# Altium schematic sheet Tarefinha.SchDoc
size A4; SheetNumber: 1; SheetTotal: 1
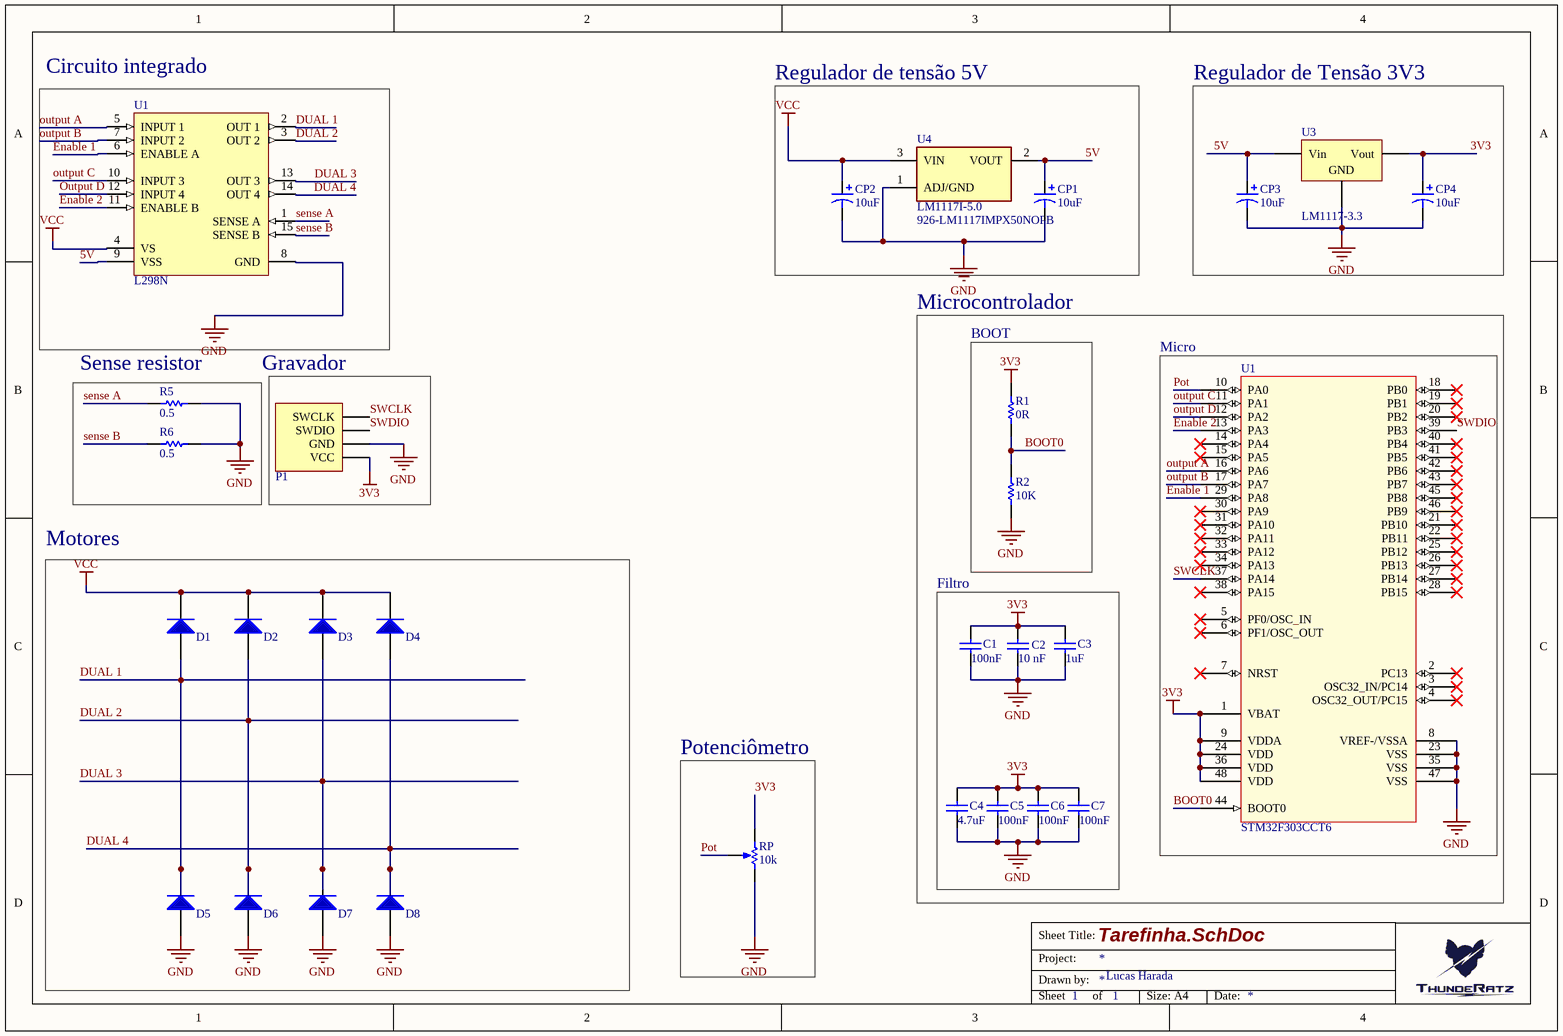
[diagram p0: Tarefinha.SchDoc]

## Parts
(Parts that share a designator on the sheet are numbered #1, #2 ... from top to bottom, then left to right.)
C1  100nF  [CAP CER DISK 100NF 50V - duplicate]
C2  10 nF  [Cap Film 0.1uF]
C3  1uF  [Cap Film 0.1uF]
C4  4.7uF  [CAP CER DISK 100NF 50V - duplicate]
C5  100nF  [CAP CER DISK 100NF 50V - duplicate]
C6  100nF  [CAP CER DISK 100NF 50V - duplicate]
C7  100nF  [CAP CER DISK 100NF 50V - duplicate]
CP1  10uF  [CAP RAD 10UF 35V]
CP2  10uF  [CAP RAD 10UF 35V]
CP3  10uF  [CAP RAD 10UF 35V]
CP4  10uF  [CAP RAD 10UF 35V]
D1  1n4148  [DO-41]  (value not drawn)
D2  1n4148  [DO-41]  (value not drawn)
D3  1n4148  [DO-41]  (value not drawn)
D4  1n4148  [DO-41]  (value not drawn)
D5  1n4148  [DO-41]  (value not drawn)
D6  1n4148  [DO-41]  (value not drawn)
D7  1n4148  [DO-41]  (value not drawn)
D8  1n4148  [DO-41]  (value not drawn)
P1  Gravador ST  [HDR1X4]  (value not drawn)
R1  0R  [RES 10K 1/4W CARBON FILM]
R2  10K  [RES 10K 1/4W CARBON FILM]
R5  0.5  [RES 10K 1/4W CARBON FILM]
R6  0.5  [RES 10K 1/4W CARBON FILM]
RP  Resistance (Ohms): 10k  [Pot 10k]  (hidden comment: Pot 10k)
U1#1  L298N  [STM-FM-15]
U1#2  STM32F303CCT6  [ADAPTADOR]
U3  LM1117-3.3  [TO220AB]
U4  LM1117I-5.0  Supplier Part Number 1: 926-LM1117IMPX50NOPB  [TO254P1054X470X1955-3]

## Blocks framed on the sheet
Regulador de tensão 5V: CP1 CP2 U4
Regulador de Tensão 3V3: CP3 CP4 U3
Circuito integrado: U1#1
BOOT: R1 R2
Micro: U1#2
Motores: D1-D8
Filtro: C1-C7
Potenciômetro: RP

## Nets
3V3: C1.2 C2.2 C3.2 C4.2 C5.2 C6.2 C7.2 CP4.1 P1.1(VCC) R1.1 RP.1(TOP) U1#2.1(VBAT) U1#2.9(VDDA) U1#2.24(VDD) U1#2.36(VDD) U1#2.48(VDD) U3.2(Vout)
GND: C1.1 C2.1 C3.1 C4.1 C5.1 C6.1 C7.1 CP1.2 CP2.2 CP3.2 CP4.2 D5.1 D6.1 D7.1 D8.1 P1.2(GND) R2.2 R5.2 R6.2 RP.3(BOT) U1#1.8(GND) U1#2.8(VREF-/VSSA) U1#2.23(VSS) U1#2.35(VSS) U1#2.47(VSS) U3.1(GND) U4.1(ADJ/GND)
VCC: CP2.1 D1.2 D2.2 D3.2 D4.2 U1#1.4(VS) U4.3(VIN)
5V: CP1.1 CP3.1 U1#1.9(VSS) U3.3(Vin) U4.2(VOUT)
BOOT0: R1.2 R2.1 U1#2.44(BOOT0)
DUAL 1: D1.1 D5.2 U1#1.2(OUT_1)
DUAL 2: D2.1 D6.2 U1#1.3(OUT_2)
DUAL 3: D3.1 D7.2 U1#1.13(OUT_3)
DUAL 4: D4.1 D8.2 U1#1.14(OUT_4)
Enable 1: U1#1.6(ENABLE_A) U1#2.29(PA8)
Enable 2: U1#1.11(ENABLE_B) U1#2.13(PA3)
output A: U1#1.5(INPUT_1) U1#2.16(PA6)
output B: U1#1.7(INPUT_2) U1#2.17(PA7)
output C: U1#1.10(INPUT_3) U1#2.11(PA1)
output D: U1#1.12(INPUT_4) U1#2.12(PA2)
Pot: RP.2(TAP) U1#2.10(PA0)
sense A: R5.1 U1#1.1(SENSE_A)
sense B: R6.1 U1#1.15(SENSE_B)
SWCLK: P1.4(SWCLK) U1#2.37(PA14)
SWDIO: P1.3(SWDIO) U1#2.39(PB3)

Not connected (* = marked no-connect by the designer): U1#2 2(PC13)* 3(OSC32_IN/PC14)* 4(OSC32_OUT/PC15)* 5(PF0/OSC_IN)* 6(PF1/OSC_OUT)* 7(NRST)* 14(PA4)* 15(PA5)* 18(PB0)* 19(PB1)* 20(PB2)* 21(PB10)* 22(PB11)* 25(PB12)* 26(PB13)* 27(PB14)* 28(PB15)* 30(PA9)* 31(PA10)* 32(PA11)* 33(PA12)* 34(PA13)* 38(PA15)* 40(PB4)* 41(PB5)* 42(PB6)* 43(PB7)* 45(PB8)* 46(PB9)*

## Notes on the sheet
- Microcontrolador
- (near R5) Sense resistor
- (near P1) Gravador
- Lucas Harada
- Sheet Title:
- Project:
- Drawn by:
- Sheet
- of
- Size: A4
- Date:

## Library data of the parts
C1 C5-C7 = Capacitor 100nF - 25V: CAP CER 0.1UF 25V Y5V 0603; Manufacturer: KEMET; Manufacturer Part Number: C0603C104Z3VACTU; Capacitance: 0.1µF; Capacitance Tolerance: +80%, -20%; Capacitor Case Style: 0603 ^1608 Metric]; Capacitor Terminals: SMD; Supplier 1: Mouser; Stock 1: 1512660; Pricing 1: 1=0.1, 10=0.015, 50=0.015, 100=0.011, 1000=0.007, 10000=0.005 (USD); Operating Temperature Range: -30°C to +85°C; Dielectric Characteristic: Y5V; Voltage Rating: 25V; ComponentLink1URL: http://www.farnell.com/datasheets/1470417.pdf; ComponentLink1Description: http://www.farnell.com/datasheets/1470417.pdf; ComponentLink2URL: http://www.farnell.com/datasheets/1828802.pdf; ComponentLink2Description: http://www.farnell.com/datasheets/1828802.pdf; ComponentLink3URL: http://www.alliedelec.com/m/d/9bfe7773041ffe9d406e68bc7b377fdd.pdf; ComponentLink3Description: http://www.alliedelec.com/m/d/9bfe7773041ffe9d406e68bc7b377fdd.pdf; Supplier Part Number 1: 80-C0603C104Z3V
C2 = Capacitor 10 uF: MURATA         ZRB18AR61E106ME01L             SMD Multilayer Ceramic Capacitor, 0603 [1608 Metric], 10 F, 25 V,  20%, X5R, ZRA Series; Capacitance: 10µF; Voltage - Rated: 25V; Supplier 1: Digi-Key; Manufacturer: Murata; Manufacturer Part Number: ZRB18AR61E106ME01L; Stock 1: 30000; Pricing 1: 1=0.63, 10=0.446, 100=0.2934, 500=0.2174, 1000=0.1848 (USD); Category: Capacitors; Family: Ceramic Capacitors; Series: ZRB; Packaging: Tape & Reel (TR); Tolerance: ±20%; Temperature Coefficient: X5R; Mounting Type: Surface Mount, MLCC; Operating Temperature: -55°C ~ 85°C; Applications: Acoustic Noise Reduction; Ratings: -; Package / Case: 0603 (1608 Metric); Size / Dimension: 0.063" L x 0.031" W (1.60mm x 0.80mm); Height - Seated (Max): -; Thickness (Max): 0.047" (1.20mm); Lead Spacing: -; Features: Interposer Termination; Lead Style: -; Supplier Part Number 1: 490-10991-1-ND
C3 = Capacitor 1uF: Manufacturer: Rohm; Manufacturer Part Number: TCM1E105M8R; Supplier 1: Mouser; Stock 1: 8000; Pricing 1: 1=0.39, 10=0.247, 50=0.247, 100=0.106, 1000=0.082, 10000=0.055 (USD); Supplier Part Number 1: 755-TCM1E105M8R
C4 = Capacitor 4.7uF: CAP CER 4.7UF 35V X5R 0603; Manufacturer: TDK; Manufacturer Part Number: C1608X5R1V475K080AC; PCN Part Number: MLCC Part Number Change 30/Nov/2012; Product Training Modules: SEAT, CCV, and TVCL Design Tools Guide to Replacing an Electrolytic Capacitor with an MLCC; Design Resources: 20 W Non-Isolated Buck LED Driver Using PL LNK460KG; Capacitance: 4.7µF; Tolerance: ±10%; Online Catalog: C Series, General Purpose; Kits: 445-9014-KIT-ND  - KIT MLCC 100PF-22UF 0603 10-50V; Other Names: 445-9064-1; Supplier 1: Digi-Key; Stock 1: 382; Pricing 1: 1=0.6, 10=0.417, 100=0.2501, 500=0.1876, 1000=0.1584 (USD); RoHS Information: RoHS Certificate-MLCC; Standard Package: 1; Category: Capacitors; Family: Ceramic Capacitors; Series: C; Packaging: Cut Tape (CT); Voltage - Rated: 35V; Temperature Coefficient: X5R; Mounting Type: Surface Mount, MLCC; Operating Temperature: -55°C ~ 85°C; Applications: General Purpose; Ratings: -; Package / Case: 0603 (1608 Metric); Size / Dimension: 0.063" L x 0.031" W (1.60mm x 0.80mm); Height - Seated (Max): -; Thickness (Max): 0.039" (1.00mm); Lead Spacing: -; Features: -; Lead Style: -; ComponentLink1URL: http://www.mouser.com/ds/2/400/lcc_commercial_general_en-837201.pdf; ComponentLink1Description: http://www.mouser.com/ds/2/400/lcc_commercial_general_en-837201.pdf; Supplier Part Number 1: 445-9064-1-ND
CP1-CP4 = CAP ELE RAD 10uF 16V: Manufacturer Part Number: IMP1295; Product Range: MCGPR Series; Capacitance Tolerance: ± 20%; Voltage Rating: 16; Capacitor Terminals: Radial Leaded; Lifetime @ Temperature: 2000 hours @ 85; SVHC: No SVHC (15-Jun-2015); Leakage Current: 6; Supplier 1: Mult Comercial; Manufacturer: -; RoHS: YES; Stock 1: 33826; Pricing 1: 1=0.50 (BRL); Capacitance: 10uF; Diameter: 5; Packaging: Each; ESR: -; Height: 11; Lead Spacing: 2; Operating Temperature Min: -40; Operating Temperature Max: 85; Capacitance Tolerance ±: ± 20%; Operating Temperature Range: -40°C to +85°C<!--FANDB--><div class="features-and-benefits-container"><div class="features-and-benefits-description"><span class="features-benefits-value">The Multicomp MCGPR series capacitors are general purpose, radial leaded polarized aluminium electrolytic capacitors. MCGPR series parts cover broad range of voltage ratings and capacitance values.</span></div><div class="features-and-benefits-list"><ul class="features-and-benefits-list-list"><li class="features-and-benefits-list-item">Capacitance value ranges from 0.1µF to 22000µF for 6.3VDC to 100VDC</li><li class="features-and-benefits-list-item">Capacitance value ranges from 0.47µF to 820µF for 160VDC to 450VDC</li><li class="features-and-benefits-list-item">Tolerance of ±20%</li><li class="features-and-benefits-list-item">Endurance of 2000h at 85°C</li><li class="features-and-benefits-list-item">Available in -40°C to 85°C and -25°C to 85; ComponentLink1URL: http://loja.multcomercial.com.br/capacitor-eletrolitico-10uf-16v.html; ComponentLink1Description: http://loja.multcomercial.com.br/capacitor-eletrolitico-10uf-16v.html; Supplier Part Number 1: Capacitor Eletrolítico 10uF/16V
D1-D8 = 1n4148: DIODE GEN PURP 75V 2A SOD123; Manufacturer: Vishay Semiconductor Diodes Division; Manufacturer Part Number: 1N4148W-E3-08; Diode Type: Standard; Current - Average Rectified (Io): 150mA; Voltage - Forward (Vf) (Max) @ If: 1.2V @ 100mA; Speed: Small Signal =< 200mA (Io), Any Speed; Reverse Recovery Time (trr): 4ns; Current - Reverse Leakage @ Vr: 100µA @ 100V; Capacitance @ Vr, F: 4pF @ 0V, 1MHz; Supplier 1: Digi-Key; RoHS: RoHS Compliant; Category: Discrete Semiconductor Products; Stock 1: 32600; Pricing 1: 1=0.23, 10=0.188, 25=0.1576, 100=0.0998, 250=0.07704, 500=0.06566, 1000=0.04465 (USD); Packaging: Cut Tape (CT); Part Status: Active; Voltage - DC Reverse (Vr) (Max): 75V; Mounting Type: Surface Mount; Package / Case: SOD-123; Supplier Device Package: SOD-123; Operating Temperature - Junction: 150°C (Max); ComponentLink1URL: http://www.vishay.com/docs/85748/1n4148w.pdf; ComponentLink1Description: http://www.vishay.com/docs/85748/1n4148w.pdf; Supplier Part Number 1: 1N4148W-E3-08CT-ND
P1 = Gravador ST: Headers & Wire Housings 40Pin 2mm Spacing Single Row Hdrs, 5pc; Manufacturer: Cromax; Manufacturer Part Number: IMP10327; Mounting Angle: Vertical; Number of Positions: 40 Position; Supplier 1: Mult Comercial; RoHS: RoHS Compliant; Category: Headers & Wire Housings; Stock 1: 14; Pricing 1: 1=1.00, 5=0.20 (BRL); Accessory Type: -; Contact Plating: Gold; Contact Type: -; Number of Rows: 1 Row; Product: Headers; Termination Style: Through Hole; Type: Breakaway; Brand: Cromax; Mounting Style: Straight Pin; Pitch: 2 mm; Row Spacing: -; Contact Gender: Pin (Male); Product Category: Accessories; RoHS - Mouser: Y; Minimum Order Quantity: 1; Reeling: False; ComponentLink1URL: http://loja.multcomercial.com.br/barra-de-pinos-simples-1x40-macho-bmo40-1e.html; ComponentLink1Description: http://loja.multcomercial.com.br/barra-de-pinos-simples-1x40-macho-bmo40-1e.html; Supplier Part Number 1: Barra de Pinos Simples 1x40 Macho BMO40-1E
R1 R5 R6 = RES 0R 0603: Res Thick Film 0603 0 Ohm Molded SMD Automotive T/R; Manufacturer: Panasonic ECG; Manufacturer Part Number: ERJ-3GEY0R00V; Resistance (Ohms): 0.0; Tolerance: Jumper; Power (Watts): 0.1W, 1/10W; EDA / CAD Models: Download from Accelerated Designs; Online Catalog: ERJ Series; Other Names: P0.0GDKR; Packaging: Digi-Reel®; ComponentLink1URL: https://datasheet.ciiva.com/48532/aoa0000ce1-48532165.pdf; ComponentLink1Description: https://datasheet.ciiva.com/48532/aoa0000ce1-48532165.pdf; ComponentLink2URL: https://datasheet.ciiva.com/43460/1678796-43460647.pdf; ComponentLink2Description: https://datasheet.ciiva.com/43460/1678796-43460647.pdf; Category: Resistors; Composition: Thick Film; Features: Automotive AEC-Q200; Temperature Coefficient: -; Operating Temperature: -55°C ~ 155°C; Package / Case: 0603 (1608 Metric); Supplier Device Package: 0603; Size / Dimension: 0.063" L x 0.031" W (1.60mm x 0.80mm); Height: 0.022" (0.55mm); Number of Terminations: 2; ComponentLink3URL: https://datasheet.ciiva.com/27055/1935748-27055113.pdf; ComponentLink3Description: https://datasheet.ciiva.com/27055/1935748-27055113.pdf; Supplier 1: Mouser; Stock 1: 0; Pricing 1: 1=0.1, 10=0.012, 50=0.012, 100=0.008, 1000=0.003, 10000=0.002 (USD); Series: ERJ; ComponentLink4URL: https://datasheet.ciiva.com/28695/1678796-28695833.pdf; ComponentLink4Description: https://datasheet.ciiva.com/28695/1678796-28695833.pdf; Supplier Part Number 1: 667-ERJ-3GEY0R00V; Standard Package: 1; Family: Chip Resistor - Surface Mount; ComponentLink5URL: https://datasheet.ciiva.com/5959/1678796-5959707.pdf; ComponentLink5Description: https://datasheet.ciiva.com/5959/1678796-5959707.pdf; ComponentLink6URL: https://datasheet.ciiva.com/16834/aoa0000ce1-16834828.pdf; ComponentLink6Description: https://datasheet.ciiva.com/16834/aoa0000ce1-16834828.pdf; ComponentLink7URL: https://datasheet.ciiva.com/17215/aoa0000ce1-17215388.pdf; ComponentLink7Description: https://datasheet.ciiva.com/17215/aoa0000ce1-17215388.pdf; ComponentLink8URL: https://datasheet.ciiva.com/46377/1678796-46377868.pdf; ComponentLink8Description: https://datasheet.ciiva.com/46377/1678796-46377868.pdf; ComponentLink9URL: https://datasheet.ciiva.com/30199/4aoa0000ce1-30199822.pdf; ComponentLink9Description: https://datasheet.ciiva.com/30199/4aoa0000ce1-30199822.pdf; ComponentLink10URL: https://datasheet.ciiva.com/9198/aoa0000ce1-9198975.pdf; ComponentLink10Description: https://datasheet.ciiva.com/9198/aoa0000ce1-9198975.pdf; ComponentLink11URL: https://datasheet.ciiva.com/11808/0900766b80f806dd-11808207.pdf; ComponentLink11Description: https://datasheet.ciiva.com/11808/0900766b80f806dd-11808207.pdf; ComponentLink12URL: https://datasheet.ciiva.com/16758/70255313-16758527.pdf; ComponentLink12Description: https://datasheet.ciiva.com/16758/70255313-16758527.pdf
R2 = RES 10K 0603: Res Thick Film 0603 10K Ohm 1% 0.1W(1/10W) ±100ppm/C Molded SMD Automotive T/R; Manufacturer: Panasonic ECG; Manufacturer Part Number: ERJ-3EKF1002V; ComponentLink1URL: https://datasheet.ciiva.com/16511/aoa0000ce2-16511861.pdf; ComponentLink1Description: https://datasheet.ciiva.com/16511/aoa0000ce2-16511861.pdf; ComponentLink2URL: https://datasheet.ciiva.com/46372/1678782-46372725.pdf; ComponentLink2Description: https://datasheet.ciiva.com/46372/1678782-46372725.pdf; Supplier 1: Mouser; Supplier Part Number 1: 667-ERJ-3EKF1002V; Stock 1: 79504; Pricing 1: 1=0.15, 10=0.014, 50=0.014, 100=0.006, 1000=0.004, 10000=0.002 (USD); Rated Power: 0.1 W; Size Code: 0603; Tolerance (%): 1 %; Temp Coefficient: 100 ppm/C; ComponentLink3URL: https://datasheet.ciiva.com/28514/426256-28514198.pdf; ComponentLink3Description: https://datasheet.ciiva.com/28514/426256-28514198.pdf; ComponentLink4URL: https://datasheet.ciiva.com/9194/aoa0000ce2-9194199.pdf; ComponentLink4Description: https://datasheet.ciiva.com/9194/aoa0000ce2-9194199.pdf; ComponentLink5URL: https://datasheet.ciiva.com/7830/aoa0000ce2-7830729.pdf; ComponentLink5Description: https://datasheet.ciiva.com/7830/aoa0000ce2-7830729.pdf; ComponentLink6URL: https://datasheet.ciiva.com/17212/aoa0000ce2-17212105.pdf; ComponentLink6Description: https://datasheet.ciiva.com/17212/aoa0000ce2-17212105.pdf; ComponentLink7URL: https://datasheet.ciiva.com/30208/aoa0000ce2-30208985.pdf; ComponentLink7Description: https://datasheet.ciiva.com/30208/aoa0000ce2-30208985.pdf; ComponentLink8URL: https://datasheet.ciiva.com/48530/aoa0000ce2-48530988.pdf; ComponentLink8Description: https://datasheet.ciiva.com/48530/aoa0000ce2-48530988.pdf; ComponentLink9URL: https://datasheet.ciiva.com/24070/aoa0000ce2-24070318.pdf; ComponentLink9Description: https://datasheet.ciiva.com/24070/aoa0000ce2-24070318.pdf; ComponentLink10URL: https://datasheet.ciiva.com/16759/70260748-16759807.pdf; ComponentLink10Description: https://datasheet.ciiva.com/16759/70260748-16759807.pdf; Resistance: 10K
RP = Pot 10k: POT 10K OHM 1/20W PLASTIC LINEAR; Manufacturer: TT Electronics/BI; Manufacturer Part Number: P120PK-Y25BR10K; Tolerance: ±20%; Built in Switch: None; Power (Watts): 0.05W, 1/20W; Number of Turns: 1; Rotation: 300°; Adjustment Type: Top Adjustment; Resistive Material: Conductive Plastic; Actuator Type: Knurled; Actuator Length: 0.984" (25.00mm); Actuator Diameter: 0.236" (6.00mm); Supplier 1: Digi-Key; RoHS: RoHS Compliant; Category: Potentiometers, Variable Resistors; Stock 1: 1210; Pricing 1: 1=0.6, 10=0.553, 25=0.4932, 50=0.476, 100=0.442, 250=0.43352, 500=0.3995, 1000=0.34, 5000=0.2805 (USD); Packaging: Tray; Part Status: Active; Taper: Linear; Temperature Coefficient: -; Termination Style: PC Pins, Board Locks; Bushing Thread: -; Mounting Type: Through Hole, Snap In; ComponentLink1URL: http://www.ttelectronics.com/sites/default/files/download-files/Datasheet_RotaryPanelPot_P120series.pdf; ComponentLink1Description: http://www.ttelectronics.com/sites/default/files/download-files/Datasheet_RotaryPanelPot_P120series.pdf; Supplier Part Number 1: 987-1710-ND
U1#1 = STM-L298-15: IC BRIDGE DRIVER PAR 15MULTIWATT
U1#2 = STM32F303CCT6: STMICROELECTRONICS         STM32F303CCT6             32 Bit Microcontroller, General Purpose, ARM Cortex-M4, 72 MHz, 256 KB, 40 KB, 48 Pins, LQFP; Other Related Documents: STM32F303CC View All Specifications; Core Processor: ARM® Cortex™-M4; Core Size: 32-Bit; Speed: 72MHz; Connectivity: CAN, I²C, IrDA, LIN, SPI, UART/USART, USB; Peripherals: DMA, I²S, POR, PWM, WDT; Number of I /O: 37; Program Memory Size: 256KB (256K x 8); Program Memory Type: FLASH; RAM Size: 48K x 8; Voltage - Supply (Vcc/Vdd): 2 V ~ 3.6 V; Data Converters: A/D 4x12b; D/A 2x12b; Oscillator Type: Internal; Dynamic Catalog: STM32 F3 Series; Other Names: 497-13318; Supplier 1: Mouser; Manufacturer: STMicroelectronics; Stock 1: 0; Pricing 1: 1=5.94, 10=5.05, 50=5.05, 100=4.38, 1000=3.14, 10000=2.99 (USD); Standard Package: 250; Category: Integrated Circuits (ICs); Family: Embedded - Microcontrollers; Series: STM32 F3; Operating Temperature: -40°C ~ 85°C; Package / Case: 48-LQFP; Packaging: Tray; ComponentLink1URL: https://datasheet.ciiva.com/14666/0900766b81171360-14666656.pdf; ComponentLink1Description: https://datasheet.ciiva.com/14666/0900766b81171360-14666656.pdf; ComponentLink2URL: https://datasheet.ciiva.com/8055/1831499-8055015.pdf; ComponentLink2Description: https://datasheet.ciiva.com/8055/1831499-8055015.pdf; Supplier Part Number 1: 511-STM32F303CCT6; Manufacturer Part Number: STM32F303CCT6
U3 = LM1117-3.3: IC REG LDO 3.3V 0.8A SOT223; Manufacturer: Texas Instruments (TI); Manufacturer Part Number: LM1117IMPX-3.3/NOPB; Dropout Voltage@Current (Max): 1.3@100mA/1.35@500mA; Dropout Voltage@Current (Typ): 1.1@100mA/1.15@500mA; Regulator Output Type: Fixed; Polarity Type: Positive; Number of Outputs: 1; Input Voltage: 15V; Output Current: 800mA; Load Regulation: 1mV; Output Voltage Accuracy: ±1%; Quiescent Current (Max): 15mA; Supplier 1: Digikey; Stock 1: 30275; Pricing 1: 1=1.04, 10=0.927, 100=0.7229, 500=0.5978, 1000=0.4728 (USD); Topology: LDO; Voltage Regulator Type: LDO; Output Voltage: 3.3V; Package Type: SOT-223; Packaging: Tape and Reel; Line Regulation: 1mV; Operating Temp Range: -40C to 125C; Operating Temperature Classification: Automotive; Pin Count: 3 +Tab; Mounting: Surface Mount; ComponentLink1URL: https://datasheet.ciiva.com/49047/1882372-49047126.pdf; ComponentLink1Description: https://datasheet.ciiva.com/49047/1882372-49047126.pdf; ComponentLink2URL: https://datasheet.ciiva.com/46386/1882372-46386044.pdf; ComponentLink2Description: https://datasheet.ciiva.com/46386/1882372-46386044.pdf; Supplier Part Number 1: LM1117IMPX-3.3/NOPBDKR-ND
U4 = LM1117I-5.0: 5V LDO Voltage Regulator 800mA; Manufacturer: Texas Instruments; Manufacturer Part Number: LM1117IMPX-5.0/NOPB; Quiescent Current: 5mA; Dropout Voltage: 1.2V; Case/Package: SOT; Number of Pins: 3; Output Voltage: 5V; Output Current: 800mA; Packaging: Tape and Reel; REACH SVHC: No SVHC; Lead Free: Lead Free; ComponentLink1Description: Datasheet; ComponentLink1URL: http://www.ti.com/lit/ds/symlink/lm1117.pdf?HQS=TI-null-null-mousermode-df-pf-null-wwe&DCM=yes&ref_url=https%3A%2F%2Fbr.mouser.com%2F; ComponentLink2Description: Mouser; ComponentLink2URL: https://br.mouser.com/ProductDetail/Texas-Instruments/LM1117IMPX-50-NOPB?qs=sGAEpiMZZMsGz1a6aV8DcCERHZHPu4lvRjG0WFCuZBk%3D; Supplier 1: Mouser